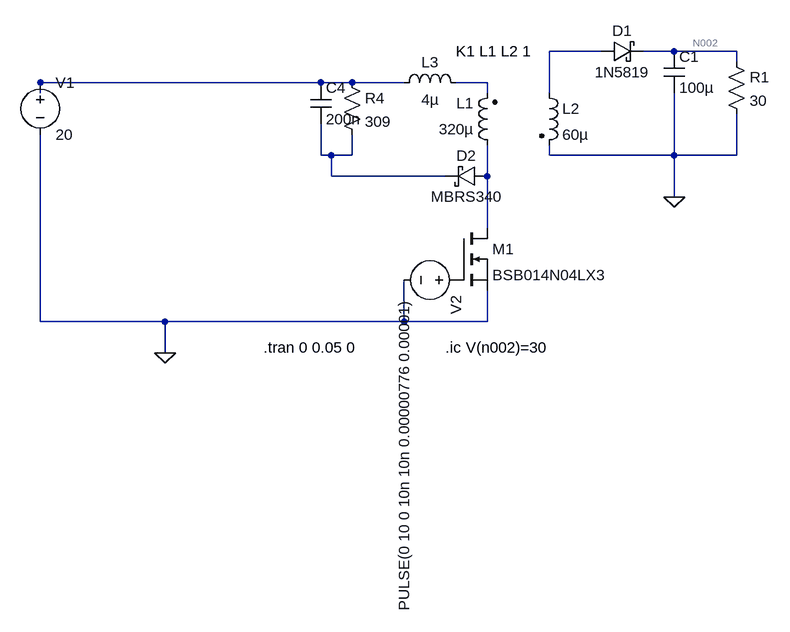
[diagram p0: schematic Snupper_simulation.asc]
Snupper_simulation.asc, the LTspice schematic file:
Version 4
SHEET 1 880 940
WIRE 320 16 240 16
WIRE 432 16 384 16
WIRE 528 16 432 16
WIRE 528 32 528 16
WIRE -112 64 -544 64
WIRE -64 64 -112 64
WIRE 16 64 -64 64
WIRE 144 64 96 64
WIRE -544 80 -544 64
WIRE 144 80 144 64
WIRE 240 80 240 16
WIRE -112 176 -112 128
WIRE -96 176 -112 176
WIRE -64 176 -64 144
WIRE -64 176 -96 176
WIRE 240 176 240 160
WIRE 432 176 432 80
WIRE 432 176 240 176
WIRE 528 176 528 112
WIRE 528 176 432 176
WIRE -96 208 -96 176
WIRE 80 208 -96 208
WIRE 144 208 144 160
WIRE 432 240 432 176
WIRE 144 288 144 208
WIRE -544 432 -544 144
WIRE -352 432 -544 432
WIRE 16 432 16 368
WIRE 16 432 -352 432
WIRE 144 432 144 384
WIRE 144 432 16 432
WIRE -352 480 -352 432
FLAG 432 240 0
FLAG -352 480 0
SYMBOL ind2 160 176 R180
WINDOW 0 36 80 Left 2
WINDOW 3 36 40 Left 2
SYMATTR InstName L1
SYMATTR Value 320µ
SYMATTR Type ind
SYMBOL ind2 224 64 R0
SYMATTR InstName L2
SYMATTR Value 60µ
SYMATTR Type ind
SYMBOL schottky 320 32 R270
WINDOW 0 32 32 VTop 2
WINDOW 3 0 32 VBottom 2
SYMATTR InstName D1
SYMATTR Value 1N5819
SYMATTR Description Diode
SYMATTR Type diode
SYMBOL cap 416 16 R0
SYMATTR InstName C1
SYMATTR Value 100µ
SYMBOL res 512 16 R0
SYMATTR InstName R1
SYMATTR Value 30
SYMBOL nmos 96 288 R0
SYMATTR InstName M1
SYMATTR Value BSB014N04LX3
SYMBOL voltage -544 48 R0
WINDOW 123 0 0 Left 2
WINDOW 39 0 0 Left 2
SYMATTR InstName V1
SYMATTR Value 20
SYMBOL voltage 112 368 R90
WINDOW 123 0 0 Left 2
WINDOW 39 0 0 Left 2
SYMATTR InstName V2
SYMATTR Value PULSE(0 10 0 10n 10n 0.00000776 0.00001)
SYMBOL schottky 144 192 R90
WINDOW 0 0 32 VBottom 2
WINDOW 3 32 32 VTop 2
SYMATTR InstName D2
SYMATTR Value MBRS340
SYMATTR Description Diode
SYMATTR Type diode
SYMBOL cap -128 64 R0
SYMATTR InstName C4
SYMATTR Value 200n
SYMBOL res -80 48 R0
SYMATTR InstName R4
SYMATTR Value 309
SYMBOL ind 0 80 R270
WINDOW 0 32 56 VTop 2
WINDOW 3 5 56 VBottom 2
SYMATTR InstName L3
SYMATTR Value 4µ
TEXT 96 16 Left 2 !K1 L1 L2 1
TEXT -200 472 Left 2 !.tran 0 0.05 0
TEXT 80 472 Left 2 !.ic V(n002)=30

The netlist it stands for:
* Snupper_simulation.asc
L1 N006 N004 320µ
L2 N001 0 60µ
D1 N001 N002 1N5819
C1 N002 0 100µ
R1 N002 0 30
M1 N006 P001 0 0 BSB014N04LX3
V1 N003 0 20
V2 P001 0 PULSE(0 10 0 10n 10n 0.00000776 0.00001)
D2 N006 N005 MBRS340
C4 N003 N005 200n
R4 N003 N005 309
L3 N003 N004 4µ
.model D D
.lib standard.dio
.model NMOS NMOS
.model PMOS PMOS
.lib standard.mos
K1 L1 L2 1
.tran 0 0.05 0
.ic V(n002)=30
.backanno
.end